# EAGLE schematic XPL-32 (EAGLE 9.6.2)
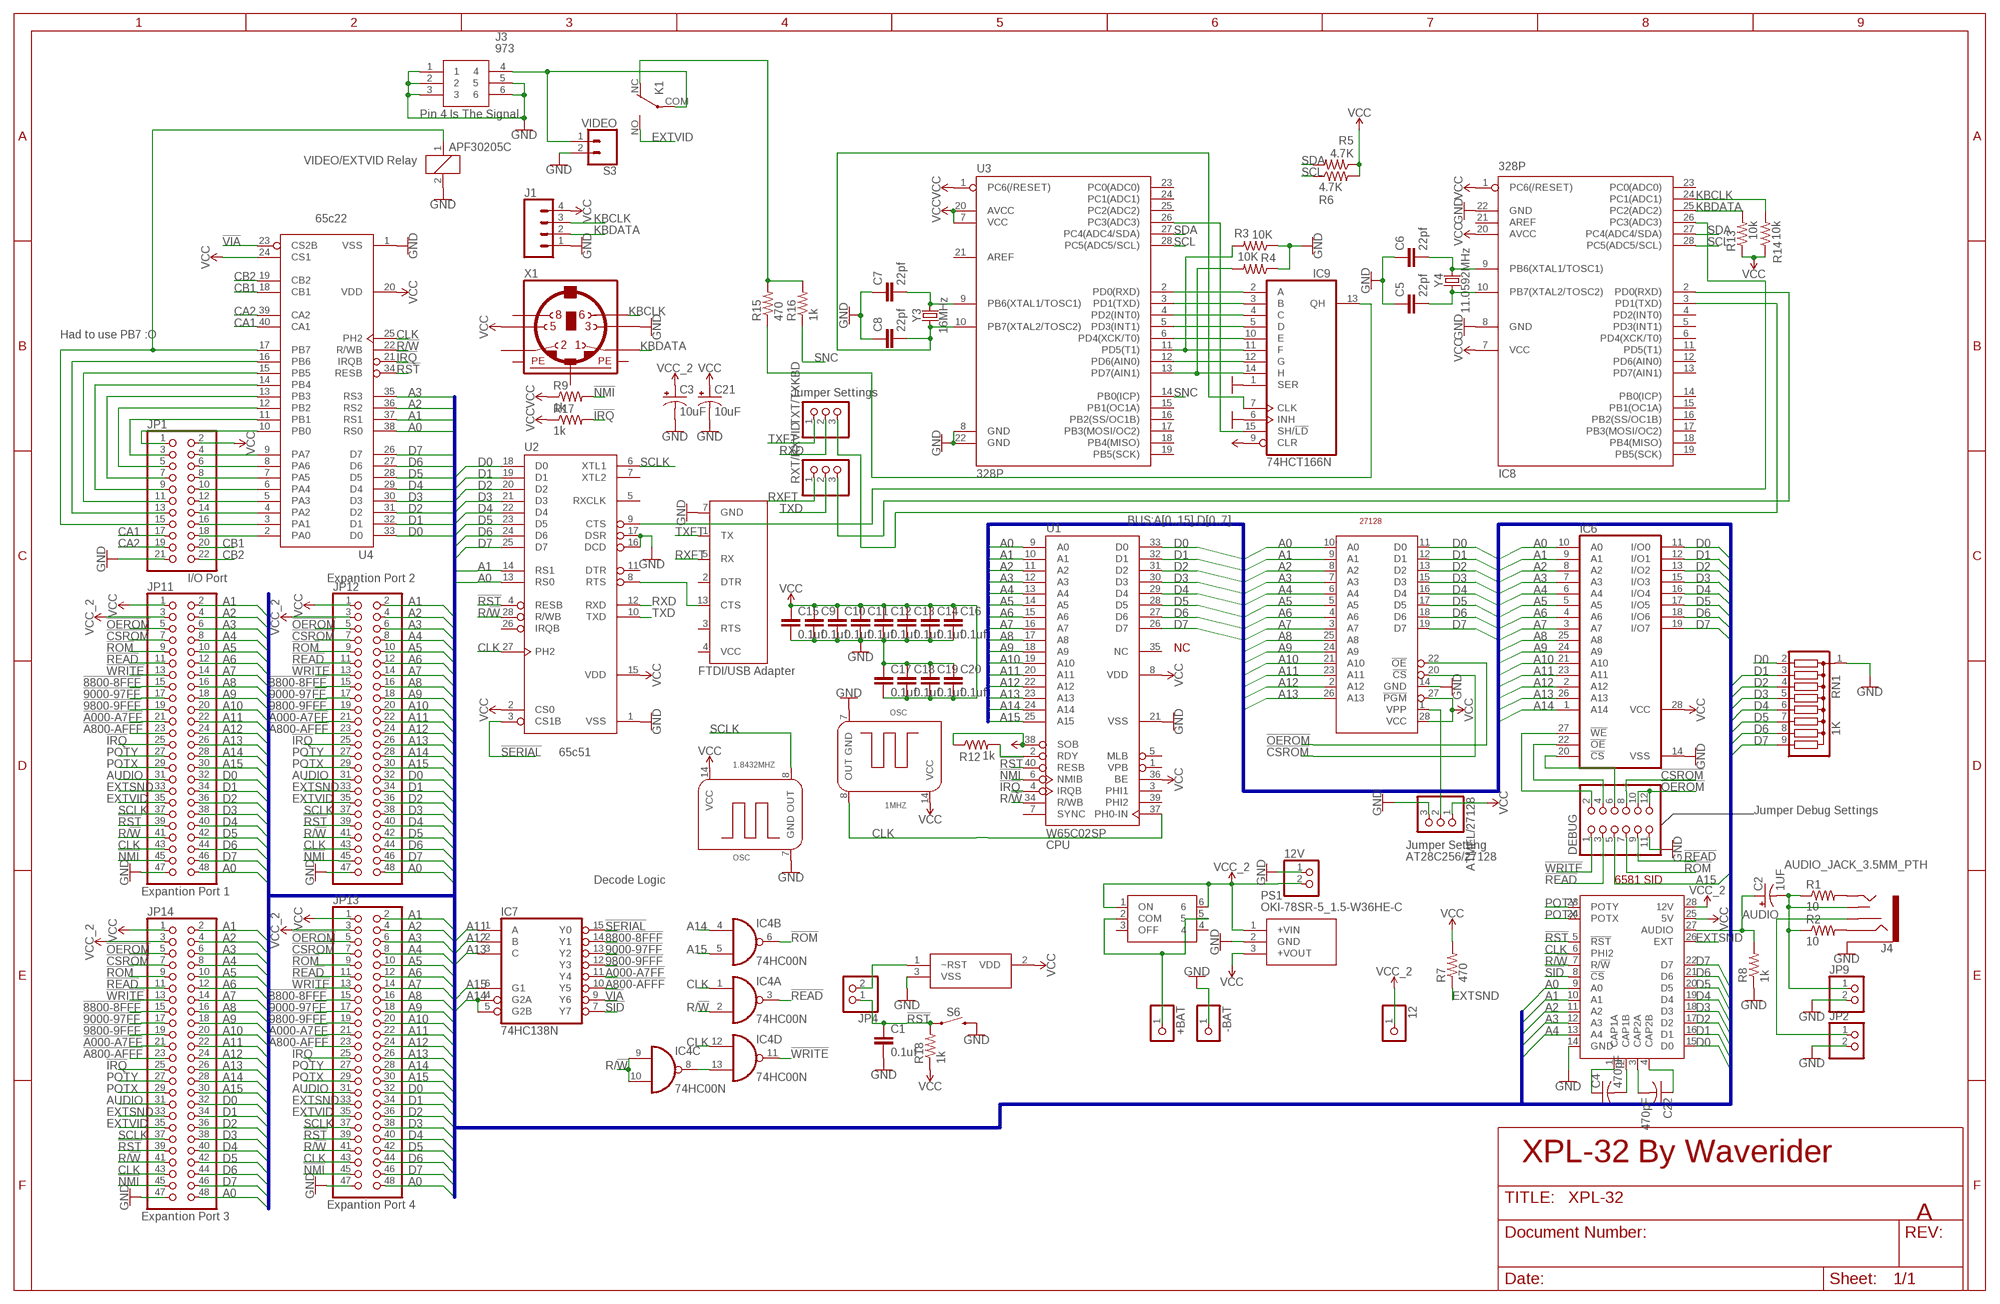
[diagram p0: schematic, sheet 1]

## Parts
1.8432MHZ  OSC  [OSCCAN]
1MHZ  OSC  [OSCCAN]
12  PINHD-1X1  [1X01]
12V  PINHD-1X2  [1X02]
+BAT  PINHD-1X1  [1X01]
-BAT  PINHD-1X1  [1X01]
ATMEL/27128  PINHD-1X3  [1X03]
C1  0.1uf  C-EU025-025X050  [C025-025X050]
C2  1UF  CPOL-USE2.5-7  [E2,5-7]
C3  10uF  CPOL-USE2.5-7  [E2,5-7]
C4  470pF  C-US150-054X183  [C150-054X183]
C5  22pf  C-EU025-025X050  [C025-025X050]
C6  22pf  C-EU025-025X050  [C025-025X050]
C7  22pf  C-EU025-025X050  [C025-025X050]
C8  22pf  C-EU025-025X050  [C025-025X050]
C9  0.1uf  C-EU025-025X050  [C025-025X050]
C10  0.1uf  C-EU025-025X050  [C025-025X050]
C11  0.1uf  C-EU025-025X050  [C025-025X050]
C12  0.1uf  C-EU025-025X050  [C025-025X050]
C13  0.1uf  C-EU025-025X050  [C025-025X050]
C14  0.1uf  C-EU025-025X050  [C025-025X050]
C15  0.1uf  C-EU025-025X050  [C025-025X050]
C16  0.1uf  C-EU025-025X050  [C025-025X050]
C17  0.1uf  C-EU025-025X050  [C025-025X050]
C18  0.1uf  C-EU025-025X050  [C025-025X050]
C19  0.1uf  C-EU025-025X050  [C025-025X050]
C20  0.1uf  C-EU025-025X050  [C025-025X050]
C21  10uF  CPOL-USE2.5-7  [E2,5-7]
C22  470pF  C-US150-054X183  [C150-054X183]
DEBUG  PINHD-2X6  [2X06]
IC4  74HC00N  [DIL14]
IC6  62256P  [DIL28-6]
IC7  74HC138N  [DIL16]
IC8  328P  MEGA8-P  [DIL28-3]
IC9  74HCT166N  74LS166N  [DIL16]
IC10  MCP120-450DI_TO  [TO127P254X495-3]
J1  CONN_041X04_NO_SILK  [1X04_NO_SILK]
J3  973  [973]
J4  AUDIO_JACK_3.5MM_PTH  [AUDIO-JACK]
JP1  PINHD-2X11/90  [2X11/90]
JP2  PINHD-1X2  [1X02]
JP4  PINHD-1X2  [1X02]
JP9  PINHD-1X2  [1X02]
JP11  PINHD-2X24/90  [2X24/90]
JP12  PINHD-2X24/90  [2X24/90]
JP13  PINHD-2X24/90  [2X24/90]
JP14  PINHD-2X24/90  [2X24/90]
K1  APF30205C  APF30212C  [APF30212C]
PS1  OKI-78SR-5_1.5-W36HE-C  [OKI78SR515W36HEC]
R1  10  R-US_0204/7  [0204/7]
R2  10  R-US_0204/7  [0204/7]
R3  10K  R-US_0204/7  [0204/7]
R4  10K  R-US_0204/7  [0204/7]
R5  4.7K  R-US_0204/7  [0204/7]
R6  4.7K  R-US_0204/7  [0204/7]
R7  470  R-US_0204/7  [0204/7]
R8  1k  R-US_0204/7  [0204/7]
R9  1k  R-US_0204/7  [0204/7]
R12  1k  R-US_0204/7  [0204/7]
R13  10k  R-US_0204/7  [0204/7]
R14  10k  R-US_0204/7  [0204/7]
R15  470  R-US_0204/7  [0204/7]
R16  1k  R-US_0204/7  [0204/7]
R17  1k  R-US_0204/7  [0204/7]
R18  1k  R-US_0204/7  [0204/7]
RN1  1K  G08R  [SIL9]
RXT/RXVID  PINHD-1X3  [1X03]
S3  VIDEO  CONN_021X02_NO_SILK  [1X02_NO_SILK]
S6  MOMENTARY-SWITCH-SPST-PTH-6.0MM  [TACTILE_SWITCH_PTH_6.0MM]
TXT/TXKBD  PINHD-1X3  [1X03]
U1  W65C02SP  [DIP-40]
U2  G65SC51P  [DIP-28]
U3  328P  ATMEGA328P_PDIP  [DIP28]
U4  G65SC22P  [DIP-40]
U6  FTDI  [FTDI]
U7  AT28C256/27128  27128  [DIP-28]
U$1  TOGGLE_PUSHBUTTON  [TOGGLE_BUTTON]
U$2  6581  [DIP-28]
X1  MINI_DIN_6  [M_DIN6]
Y3  16MHz  CRYSTALPTH-HC49UV  [HC49U]
Y4  11.0592MHz  CRYSTALPTH-HC49UV  [HC49U]

## Nets
!8800-8FFF: IC7.14(Y1) JP11.15 JP12.15 JP13.15 JP14.15
!9000-97FF: IC7.13(Y2) JP11.17 JP12.17 JP13.17 JP14.17
!9800-9FFF: IC7.12(Y3) JP11.19 JP12.19 JP13.19 JP14.19
!A000-A7FF: IC7.11(Y4) JP11.21 JP12.21 JP13.21 JP14.21
!A800-AFFF: IC7.10(Y5) JP11.23 JP12.23 JP13.23 JP14.23
!CSROM: DEBUG.8 JP11.7 JP12.7 JP13.7 JP14.7 U7.20(!CS)
!IRQ: JP11.25 JP12.25 JP13.25 JP14.25 R17.2 U1.4(IRQB) U4.21(IRQB)
!NMI: JP11.45 JP12.45 JP13.45 JP14.45 R9.2 U1.6(NMIB)
!OEROM: DEBUG.10 DEBUG.12 JP11.5 JP12.5 JP13.5 JP14.5 U7.22(!OE)
!READ: DEBUG.3 DEBUG.9 IC4.3(A:O) JP11.11 JP12.11 JP13.11 JP14.11
!ROM: DEBUG.7 IC4.6(B:O) JP11.9 JP12.9 JP13.9 JP14.9
!RST: C1.1 JP4.1 JP11.39 JP12.39 JP13.39 JP14.39 R18.2 S6.1 U1.40(RESB) U2.4(RESB) U4.34(RESB) U$2.5(!RST)
!SERIAL: IC7.15(Y0) U2.3(CS1B)
!SID: IC7.7(Y7) U$2.8(!CS)
!VIA: IC7.9(Y6) U4.23(CS2B)
!WRITE: DEBUG.1 IC4.11(D:O) JP11.13 JP12.13 JP13.13 JP14.13
A0: IC6.10(A0) JP11.48 JP12.48 JP13.48 JP14.48 U1.9(A0) U2.13(RS0) U4.38(RS0) U7.10(A0) U$2.9(A0)
A1: IC6.9(A1) JP11.2 JP12.2 JP13.2 JP14.2 U1.10(A1) U2.14(RS1) U4.37(RS1) U7.9(A1) U$2.10(A1)
A2: IC6.8(A2) JP11.4 JP12.4 JP13.4 JP14.4 U1.11(A2) U4.36(RS2) U7.8(A2) U$2.11(A2)
A3: IC6.7(A3) JP11.6 JP12.6 JP13.6 JP14.6 U1.12(A3) U4.35(RS3) U7.7(A3) U$2.12(A3)
A4: IC6.6(A4) JP11.8 JP12.8 JP13.8 JP14.8 U1.13(A4) U7.6(A4) U$2.13(A4)
A5: IC6.5(A5) JP11.10 JP12.10 JP13.10 JP14.10 U1.14(A5) U7.5(A5)
A6: IC6.4(A6) JP11.12 JP12.12 JP13.12 JP14.12 U1.15(A6) U7.4(A6)
A7: IC6.3(A7) JP11.14 JP12.14 JP13.14 JP14.14 U1.16(A7) U7.3(A7)
A8: IC6.25(A8) JP11.16 JP12.16 JP13.16 JP14.16 U1.17(A8) U7.25(A8)
A9: IC6.24(A9) JP11.18 JP12.18 JP13.18 JP14.18 U1.18(A9) U7.24(A9)
A10: IC6.21(A10) JP11.20 JP12.20 JP13.20 JP14.20 U1.19(A10) U7.21(A10)
A11: IC6.23(A11) IC7.1(A) JP11.22 JP12.22 JP13.22 JP14.22 U1.20(A11) U7.23(A11)
A12: IC6.2(A12) IC7.2(B) JP11.24 JP12.24 JP13.24 JP14.24 U1.22(A12) U7.2(A12)
A13: IC6.26(A13) IC7.3(C) JP11.26 JP12.26 JP13.26 JP14.26 U1.23(A13) U7.26(A13)
A14: IC4.4(B:I0) IC6.1(A14) IC7.4(G2A) IC7.5(G2B) JP11.28 JP12.28 JP13.28 JP14.28 U1.24(A14)
A15: DEBUG.5 IC4.5(B:I1) IC7.6(G1) JP11.30 JP12.30 JP13.30 JP14.30 U1.25(A15)
AUDIO: C2.+ JP11.31 JP12.31 JP13.31 JP14.31 R8.2 U$2.27(AUDIO)
CA1: JP1.17 U4.40(CA1)
CA2: JP1.19 U4.39(CA2)
CB1: JP1.20 U4.18(CB1)
CB2: JP1.22 U4.19(CB2)
CLK: 1MHZ.8(OUT) IC4.1(A:I0) IC4.12(D:I0) JP11.43 JP12.43 JP13.43 JP14.43 U1.37(PH0-IN) U2.27(PH2) U4.25(PH2) U$2.6(PHI2)
D0: IC6.11(I/O0) JP11.32 JP12.32 JP13.32 JP14.32 RN1.2 U1.33(D0) U2.18(D0) U4.33(D0) U7.11(D0) U$2.15(D0)
D1: IC6.12(I/O1) JP11.34 JP12.34 JP13.34 JP14.34 RN1.3 U1.32(D1) U2.19(D1) U4.32(D1) U7.12(D1) U$2.16(D1)
D2: IC6.13(I/O2) JP11.36 JP12.36 JP13.36 JP14.36 RN1.4 U1.31(D2) U2.20(D2) U4.31(D2) U7.13(D2) U$2.17(D2)
D3: IC6.15(I/O3) JP11.38 JP12.38 JP13.38 JP14.38 RN1.5 U1.30(D3) U2.21(D3) U4.30(D3) U7.15(D3) U$2.18(D3)
D4: IC6.16(I/O4) JP11.40 JP12.40 JP13.40 JP14.40 RN1.6 U1.29(D4) U2.22(D4) U4.29(D4) U7.16(D4) U$2.19(D4)
D5: IC6.17(I/O5) JP11.42 JP12.42 JP13.42 JP14.42 RN1.7 U1.28(D5) U2.23(D5) U4.28(D5) U7.17(D5) U$2.20(D5)
D6: IC6.18(I/O6) JP11.44 JP12.44 JP13.44 JP14.44 RN1.8 U1.27(D6) U2.24(D6) U4.27(D6) U7.18(D6) U$2.21(D6)
D7: IC6.19(I/O7) JP11.46 JP12.46 JP13.46 JP14.46 RN1.9 U1.26(D7) U2.25(D7) U4.26(D7) U7.19(D7) U$2.22(D7)
EXTSND: JP11.33 JP12.33 JP13.33 JP14.33 R7.1 U$2.26(EXT)
EXTVID: JP11.35 JP12.35 JP13.35 JP14.35 K1.NO(2:S)
GND: 1.8432MHZ.7(GND) 1MHZ.7(GND) 12V.1 -BAT.1 ATMEL/27128.3 C1.2 C3.- C5.1 C6.1 C7.1 C8.1 C9.2 C10.2 C11.2 C12.2 C13.2 C14.2 C15.2 C16.2 C17.1 C18.1 C19.1 C20.1 C21.- DEBUG.11 IC6.14(VSS) IC8.8(GND) IC8.22(GND) IC9.1(SER) IC9.6(INH) IC10.3(VSS) J1.1 J3.1 J3.2 J3.3 J3.5 J3.6 J4.SLEEVE JP1.21 JP2.2 JP9.2 JP11.47 JP12.47 JP13.47 JP14.47 K1.2 PS1.2(GND) R3.1 R4.1 R8.1 RN1.1 S3.2 S6.3 U1.21(VSS) U2.1(VSS) U2.16(DCD) U2.17(DSR) U3.8(GND) U3.22(GND) U4.1(VSS) U6.7(GND) U7.14(GND) U$2.14(GND) X1.3
KBCLK: IC8.24(PC1(ADC1)) J1.3 R14.2 X1.6
KBDATA: IC8.25(PC2(ADC2)) J1.2 R13.2 X1.1
N$1: ATMEL/27128.2 U7.1(VPP)
N$2: IC10.1(~RST) JP4.2
N$3: J4.RSH JP2.1
N$4: J4.TIP R1.2
N$5: +BAT.1 U$1.2(COM) U$1.5
N$6: J4.RING R2.2
N$7: IC4.8(C:O) IC4.13(D:I1)
N$8: JP1.1 U4.10(PB0)
N$9: DEBUG.2 IC6.27(!WE)
N$10: IC8.2(PD0(RXD)) RXT/RXVID.3
N$11: IC8.3(PD1(TXD)) TXT/TXKBD.3
N$12: JP1.3 U4.11(PB1)
N$13: C2.- J4.TSH JP9.1 R1.1 R2.1
N$15: JP1.5 U4.12(PB2)
N$16: JP1.15 K1.1 U4.17(PB7)
N$17: C22.2 U$2.3(CAP2A)
N$18: C4.2 U$2.2(CAP1B)
N$19: C22.1 U$2.4(CAP2B)
N$20: JP1.7 U4.13(PB3)
N$21: JP1.9 U4.14(PB4)
N$22: R12.2 U1.2(RDY)
N$23: C4.1 U$2.1(CAP1A)
N$27: U2.8(RTS) U6.13(CTS)
N$30: JP1.11 U4.15(PB5)
N$31: C6.2 IC8.9(PB6(XTAL1/TOSC1)) Y4.2
N$32: C5.2 IC8.10(PB7(XTAL2/TOSC2)) Y4.1
N$33: C7.2 U3.9(PB6(XTAL1/TOSC1)) Y3.2
N$34: C8.2 IC9.7(CLK) U3.10(PB7(XTAL2/TOSC2)) Y3.1
N$35: IC8.26(PC3(ADC3)) U2.9(CTS)
N$36: IC9.15(SH/!LD) U3.26(PC3(ADC3))
N$37: J3.4 K1.COM(2:P) S3.1
N$38: JP1.13 U4.16(PB6)
N$40: K1.NC(2:O) R15.2 R16.2
N$41: JP1.18 U4.2(PA0)
N$42: JP1.16 U4.3(PA1)
N$43: JP1.14 U4.4(PA2)
N$49: JP1.12 U4.5(PA3)
N$50: JP1.10 U4.6(PA4)
N$51: JP1.8 U4.7(PA5)
N$52: JP1.6 U4.8(PA6)
N$53: JP1.4 U4.9(PA7)
N$63: IC9.2(A) U3.2(PD0(RXD))
N$64: IC9.3(B) U3.3(PD1(TXD))
N$65: IC9.4(C) U3.4(PD2(INT0))
N$66: IC9.5(D) U3.5(PD3(INT1))
N$67: IC9.10(E) U3.6(PD4(XCK/T0))
N$68: IC9.11(F) R3.2 U3.11(PD5(T1))
N$69: IC9.12(G) U3.12(PD6(AIN0))
N$70: IC9.14(H) R4.2 U3.13(PD7(AIN1))
N$71: IC9.13(QH) R15.1
N$75: DEBUG.4 IC6.22(!OE)
N$76: DEBUG.6 IC6.20(!CS)
POTX: JP11.29 JP12.29 JP13.29 JP14.29 U$2.24(POTX)
POTY: JP11.27 JP12.27 JP13.27 JP14.27 U$2.23(POTY)
R/!W: IC4.2(A:I1) IC4.9(C:I0) IC4.10(C:I1) JP11.41 JP12.41 JP13.41 JP14.41 U1.34(R/WB) U2.28(R/WB) U4.22(R/WB) U$2.7(R/!W)
RXD: TXT/TXKBD.2 U2.12(RXD)
RXFT: RXT/RXVID.1 U6.5(RX)
SCL: IC8.28(PC5(ADC5/SCL)) R6.1 U3.28(PC5(ADC5/SCL))
SCLK: 1.8432MHZ.8(OUT) JP11.37 JP12.37 JP13.37 JP14.37 U2.6(XTL1)
SDA: IC8.27(PC4(ADC4/SDA)) R5.2 U3.27(PC4(ADC4/SDA))
SNC: R16.1 U3.14(PB0(ICP))
TXD: RXT/RXVID.2 U2.10(TXD)
TXFT: TXT/TXKBD.1 U6.1(TX)
VCC: 1.8432MHZ.14(VCC) 1MHZ.14(VCC) ATMEL/27128.1 C9.1 C10.1 C11.1 C12.1 C13.1 C14.1 C15.1 C16.1 C17.2 C18.2 C19.2 C20.2 C21.+ IC6.28(VCC) IC8.1(PC6(/RESET)) IC8.7(VCC) IC8.20(AVCC) IC9.9(CLR) IC10.2(VDD) J1.4 JP1.2 JP11.1 JP12.1 JP13.1 JP14.1 PS1.3(+VOUT) R5.1 R6.2 R7.2 R9.1 R12.1 R13.1 R14.1 R17.1 R18.1 U1.8(VDD) U1.36(BE) U1.38(SOB) U2.2(CS0) U2.15(VDD) U3.1(PC6(/RESET)) U3.7(VCC) U3.20(AVCC) U4.20(VDD) U4.24(CS1) U7.27(!PGM) U7.28(VCC) U$2.25(5V) X1.5
VCC_2: 12.1 12V.2 C3.+ JP11.3 JP12.3 JP13.3 JP14.3 PS1.1(+VIN) U$1.1(ON) U$1.6 U$2.28(12V)
Unconnected: IC8.4(PD2(INT0)) IC8.5(PD3(INT1)) IC8.6(PD4(XCK/T0)) IC8.11(PD5(T1)) IC8.12(PD6(AIN0)) IC8.13(PD7(AIN1)) IC8.14(PB0(ICP)) IC8.15(PB1(OC1A)) IC8.16(PB2(SS/OC1B)) IC8.17(PB3(MOSI/OC2)) IC8.18(PB4(MISO)) IC8.19(PB5(SCK)) IC8.21(AREF) IC8.23(PC0(ADC0)) U1.1(VPB) U1.3(PHI1) U1.5(MLB) U1.7(SYNC) U1.35(NC) U1.39(PHI2) U2.5(RXCLK) U2.7(XTL2) U2.11(DTR) U2.26(IRQB) U3.15(PB1(OC1A)) U3.16(PB2(SS/OC1B)) U3.17(PB3(MOSI/OC2)) U3.18(PB4(MISO)) U3.19(PB5(SCK)) U3.21(AREF) U3.23(PC0(ADC0)) U3.24(PC1(ADC1)) U3.25(PC2(ADC2)) U6.2(DTR) U6.3(RTS) U6.4(VCC) U$1.3(OFF) U$1.4 X1.2 X1.8

## Buses
BUS:A[0..15],D[0..7]

## Notes on the sheet
- Pin 4 Is The Signal.
- VIDEO/EXTVID Relay
- 65c22
- Had to use PB7 :O
- Jumper Settings
- I/O Port | Expantion Port 2
- FTDI/USB Adapter
- 65c51
- Jumper Debug Settings
- CPU | Jumper Setting
- AT28C256/27128
- Decode Logic
- Expantion Port 1
- XPL-32 | By Waverider
- Expantion Port 4
- Expantion Port 3 | A

## Power pins joined to a net without a drawn wire
GND: IC4.7(P:GND) IC7.8(GND) IC9.8(GND)
PE1: X1.SH1(PE1)
PE2: X1.SH2(PE2)
PE3: X1.SH3(PE3)
VCC: IC4.14(P:VCC) IC7.16(VCC) IC9.16(VCC)

## Library data of the parts
1.8432MHZ 1MHZ = Liam's Inventions:OSC
12 +BAT -BAT = pinhead:PINHD-1X1: PIN HEADER
12V JP2 JP4 JP9 = pinhead:PINHD-1X2: PIN HEADER
ATMEL/27128 RXT/RXVID TXT/TXKBD = adafruit:PINHD-1X3: PIN HEADER
C1 C5-C20 = rcl:C-EU: CAPACITOR, European symbol; SPICEPREFIX: C
C2 C3 C21 = adafruit:CPOL-US: POLARIZED CAPACITOR, American symbol
C4 C22 = adafruit:C-US: CAPACITOR, American symbol
DEBUG = pinhead:PINHD-2X6: PIN HEADER
IC4 = 74xx-eu:74*00: Quad 2-input NAND gate
IC6 = memory-hitachi:62256P: MEMORY; OC_FARNELL: unknown; OC_NEWARK: unknown
IC7 = 74xx-eu:74*138: 3-line to 8-line DECODER/DEMULTIPLEXER
IC8 = atmel:MEGA8-P: MICROCONTROLLER 8 Kbytes FLASH, 1 kbytes SRAM, 512 bytes EEPROM, USART, 4-channel 10 bit ADC, 2-channel 8 bit ADC Pin compatible with Atmega48, ATMega88, ATMega168 Source: avr.lbr; OC_FARNELL: unknown; OC_NEWARK: unknown
IC9 = 74xx-us:74*166: 8-bit parallel load SHIFT REGISTER
IC10 = SamacSys_Parts:MCP120-450DI_TO: MCU VOLT SUPERVISOR Source: Datasheet; DESCRIPTION: MCU VOLT SUPERVISOR; HEIGHT: mm; MANUFACTURER_NAME: Microchip; MANUFACTURER_PART_NUMBER: MCP120-450DI/TO; MOUSER_PART_NUMBER: 579-MCP120-450DI/TO; MOUSER_PRICE-STOCK: https://www.mouser.co.uk/ProductDetail/Microchip-Technology/MCP120-450DI-TO?qs=sX%2FisSQq3c699aLRZYrX5w%3D%3D
J1 = SparkFun-Connectors:CONN_04: Multi connection point. Often used as Generic Header-pin footprint for 0.1 inch spaced/style header connections On any of the 0.1 inch spaced packages, you can populate with these: Break Away Headers - Straight <https://www.sparkfun.com/products/116> (PRT-00116) Break Away Male Headers - Right Angle <https://www.sparkfun.com/products/553> (PRT-00553) Female Headers <https://www.sparkfun.com/products/115> (PRT-00115) Break Away Headers - Machine Pin <https://www.sparkfun.com/products/117> (PRT-00117) Break Away Female Headers - Swiss Machine Pin <https://www.sparkfun.com/products/743> (PRT-00743) For SCREWTERMINALS and SPRING TERMINALS visit here: Screw Terimnals on SparkFun.com <https://www.sparkfun.com/search/results?term=Screw+Terminals> (5mm/3.5mm/2.54mm spacing) This device is also useful as a general connection point to wire up your design to another part of your project. Our various solder wires solder well into these plated through hole pads. Hook-Up Wire - Assortment (Stranded, 22 AWG) <https://www.sparkfun.com/products/11375> (PRT-11375) Hook-Up Wire - Assortment (Solid Core, 22 AWG) <https://www.sparkfun.com/products/11367> (PRT-11367) View the entire wire category on our website here <https://www.sparkfun.com/categories/141> Special notes: Molex polarized connector foot print use with SKU : PRT-08231 with associated crimp pins and housings. 1MM SMD Version SKU: PRT-10208; PROD_ID: CONN-09696
J3 = SamacSys_Parts:973: RCA Phono Connectors RCA PCB JACK YELLOW Source: Datasheet <https://componentsearchengine.com/Datasheets/1/973.pdf>; DESCRIPTION: RCA Phono Connectors RCA PCB JACK YELLOW; HEIGHT: 13mm; MANUFACTURER_NAME: Keystone Electronics; MANUFACTURER_PART_NUMBER: 973; MOUSER_PART_NUMBER: 534-973; MOUSER_PRICE-STOCK: https://www.mouser.co.uk/ProductDetail/Keystone-Electronics/973?qs=sOYabIlKNmcMm%252BHv8SuOtQ%3D%3D
J4 = SparkFun-Connectors:AUDIO_JACK_3.5MM: Audio Jack 3.5mm variants of PTH and SMT stereo audio jack with bypass switches. SparkFun Products: SparkFun SparkPunk Sound Kit <[https://www.sparkfun.com/products/11177]> - PTH MP3 Trigger <https://www.sparkfun.com/products/13720> -3.5mm SMD SparkFun PicoBoard <https://www.sparkfun.com/products/11888>- 2.5mm SMD; PROD_ID: CONN-08774; SF_ID: PRT-08032
JP1 = pinhead:PINHD-2X11: PIN HEADER
JP11-JP14 = pinhead:PINHD-2X24: PIN HEADER
K1 = relay:APF30212C: Compliant with European standards 1a/1c 6A Slim power relays Source: Data sheet <http://pewa.panasonic.com/assets/pcsd/catalog/pf-catalog.pdf>; OC_FARNELL: unknown
PS1 = SamacSys_Parts:OKI-78SR-5_1.5-W36HE-C: Murata Power Solutions Non-Isolated DC-DC Converter, 12V dc Input, 5V dc Output, 1.5A Source: Datasheet <https://power.murata.com/data/power/oki-78sr-e.pdf>; DESCRIPTION: Murata Power Solutions Non-Isolated DC-DC Converter, 12V dc Input, 5V dc Output, 1.5A; HEIGHT: 9.5mm; MANUFACTURER_NAME: Murata Electronics; MANUFACTURER_PART_NUMBER: OKI-78SR-5/1.5-W36HE-C; MOUSER_PART_NUMBER: 580-O78SR5/1.5W36HEC; MOUSER_PRICE-STOCK: https://www.mouser.co.uk/ProductDetail/Murata-Power-Solutions/OKI-78SR-5-15-W36HE-C?qs=AQlKX63v8Ru%252BEtbp1ey3tw%3D%3D
R1-R9 R12-R18 = adafruit:R-US_: RESISTOR, American symbol
RN1 = resistor-sil:G08R: SIL RESISTOR; OC_FARNELL: unknown; OC_NEWARK: unknown
S3 = SparkFun-Connectors:CONN_02: Multi connection point. Often used as Generic Header-pin footprint for 0.1 inch spaced/style header connections On any of the 0.1 inch spaced packages, you can populate with these: Break Away Headers - Straight <https://www.sparkfun.com/products/116> (PRT-00116) Break Away Male Headers - Right Angle <https://www.sparkfun.com/products/553> (PRT-00553) Female Headers <https://www.sparkfun.com/products/115> (PRT-00115) Break Away Headers - Machine Pin <https://www.sparkfun.com/products/117> (PRT-00117) Break Away Female Headers - Swiss Machine Pin <https://www.sparkfun.com/products/743> (PRT-00743) For SCREWTERMINALS and SPRING TERMINALS visit here: Screw Terimnals on SparkFun.com <https://www.sparkfun.com/search/results?term=Screw+Terminals> (5mm/3.5mm/2.54mm spacing) This device is also useful as a general connection point to wire up your design to another part of your project. Our various solder wires solder well into these plated through hole pads. Hook-Up Wire - Assortment (Stranded, 22 AWG) <https://www.sparkfun.com/products/11375> (PRT-11375) Hook-Up Wire - Assortment (Solid Core, 22 AWG) <https://www.sparkfun.com/products/11367> (PRT-11367) View the entire wire category on our website here <https://www.sparkfun.com/categories/141> Special notes: Molex polarized connector foot print use with: PRT-08233 with associated crimp pins and housings. 2.54_SCREWTERM for use with PRT-10571. 3.5mm Screw Terminal footprints for PRT-08084 5mm Screw Terminal footprints for use with PRT-08432
S6 = SparkFun-Switches:MOMENTARY-SWITCH-SPST: Momentary Switch (Pushbutton) - SPST Normally-open (NO) SPST momentary switches (buttons, pushbuttons). Variants PTH-12MM - 12mm square, through-hole Momentary Pushbutton Switch - 12mm Square <https://www.sparkfun.com/products/9190> (COM-09190) PTH-6.0MM, PTH-6.0MM-KIT - 6.0mm square, through-hole Mini Pushbutton Switch <https://www.sparkfun.com/products/97> (COM-00097) KIT package intended for soldering kit's - only one side of pads' copper is exposed. PTH-RIGHT-ANGLE-KIT - Right-angle, through-hole Right Angle Tactile Button <https://www.sparkfun.com/products/10791> - Used on SparkFun BigTime Watch Kit <https://www.sparkfun.com/products/11734> SMD-12MM - 12mm square, surface-mount Tactile Button - SMD (12mm) <https://www.sparkfun.com/products/12993> (COM-12993) Used on SparkFun PicoBoard <https://www.sparkfun.com/products/11888> SMD-4.5MM - 4.5mm Square Trackball Switch Used on SparkFun Blackberry Trackballer Breakout <https://www.sparkfun.com/products/13169> SMD-4.6MMX2.8MM - 4.60mm x 2.80mm, surface mount Used on SparkFun SAMD21 Mini Breakout <https://www.sparkfun.com/products/13664> SMD-5.2MM, SMD-5.2-REDUNDANT - 5.2mm square, surface-mount Mini Pushbutton Switch - SMD <https://www.sparkfun.com/products/8720> (COM-08720) Used on Arduino Pro Mini <https://www.sparkfun.com/products/11114> REDUNDANT package connects both switch circuits together SMD-6.0X3.5MM - 6.0 x 3.5mm, surface mount Momentary Reset Switch SMD <https://www.sparkfun.com/products/8229> (COM-08229) SMD-6.2MM-TALL - 6.2mm square, surface mount Tactile Button - SMD (6mm) <https://www.sparkfun.com/products/12992> Used on SparkFun Digital Sandbox <https://www.sparkfun.com/products/12651> SMD-RIGHT-ANGLE - Right-angle, surface mount Used on SparkFun Block for Intel® Edison - Arduino <https://www.sparkfun.com/products/13036>; PROD_ID: SWCH-08441; SF_SKU: COM-00097
U1 = 65xxx:W65C02SP: Western Digital Version
U2 = 65xxx:G65SC51P: California Micro Devices Version
U3 = SparkFun-IC-Microcontroller:ATMEGA328P_PDIP: Atmel 328P Through hole ATMEGA328P uC used in the Arduino 32kb flash, 1k EEPROM, 2k SRAM Datasheet <http://www.sparkfun.com/datasheets/Components/SMD/ATMega328.pdf> SparkFun Products Storefront component: AVR 28 Pin 20MHz 32K 6A/D - ATMega328P <https://www.sparkfun.com/products/9061> (COM-09061) SparkFun Simon Says - Through-Hole Soldering Kit <https://www.sparkfun.com/products/10547> (KIT-10547) SparkFun Learn to Solder - Simon Says <https://www.sparkfun.com/products/13708> (KIT-13708) SparkFun BigTime Watch Kit <https://www.sparkfun.com/products/11734> (KIT-11734) SparkFun ClockIt <https://www.sparkfun.com/products/10930> (KIT-10930) SparkFun Serial Enabled LCD Kit <https://www.sparkfun.com/products/10097> (LCD-10097) SparkFun Simon Tilts - Through Hole Soldering Kit <https://www.sparkfun.com/products/12634> (KIT-12634) SparkFun Frequency Counter Kit <https://www.sparkfun.com/products/10140> (KIT-10140) FabFM Radio Kit <https://www.sparkfun.com/products/11043> (KIT-11043) SparkFun Binary Blaster Kit <https://www.sparkfun.com/products/12037> (KIT-12037) SparkFun Metro-Gnome <https://www.sparkfun.com/products/9236> (KIT-09236) ATmega328 with Arduino Optiboot (Uno) <https://www.sparkfun.com/products/10524> (DEV-10524); PROD_ID: IC-09136
U4 = 65xxx:G65SC22P: California Micro Devices Version
U6 = Liam's Inventions:FTDI
U7 = Liam's Inventions:27128
U$1 = Liam's Inventions:TOGGLE_PUSHBUTTON
U$2 = Liam's Inventions:6581
X1 = mini_din:MINI_DIN_6
Y3 Y4 = SparkFun-Clocks:CRYSTAL: Crystals (Generic) These are passive quartz crystals, which can be used as a clock source for a microcontroller. Crystal's are two-terminal devices. They require external "load" capacitors to generate an oscillating signal.